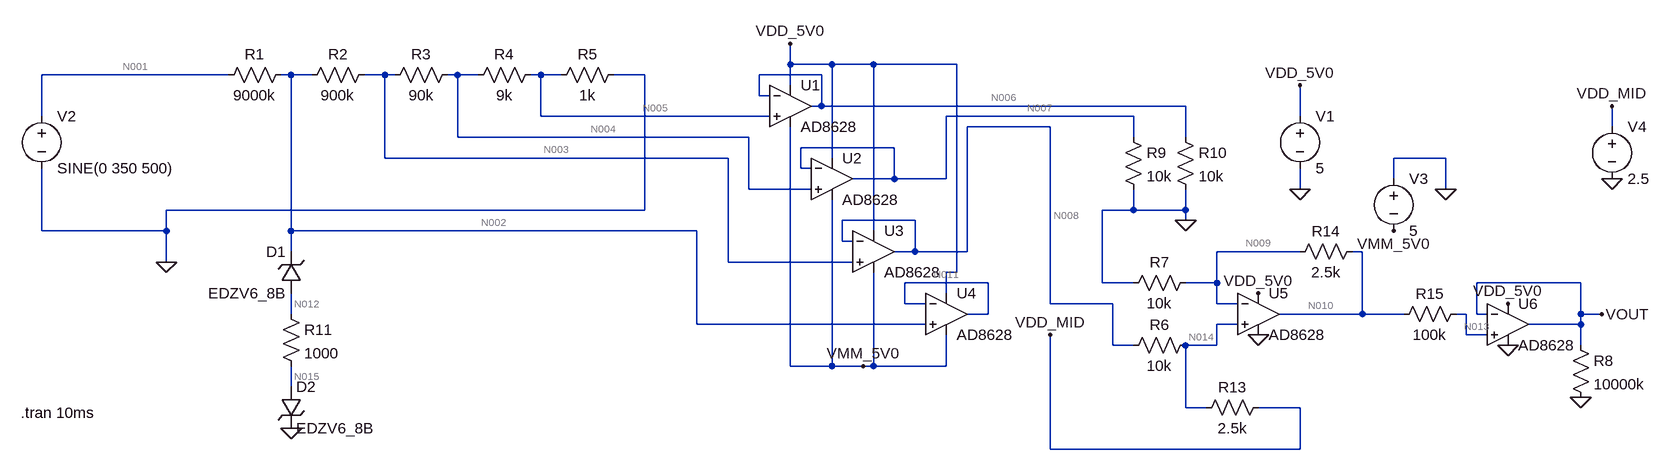
[diagram p0: schematic front_end_proto.asc]
front_end_proto.asc, the LTspice schematic file:
Version 4
SHEET 1 2288 680
WIRE 960 -320 960 -352
WIRE 1024 -320 960 -320
WIRE 1088 -320 1024 -320
WIRE 1216 -320 1088 -320
WIRE 96 -304 -192 -304
WIRE 192 -304 176 -304
WIRE 224 -304 192 -304
WIRE 336 -304 304 -304
WIRE 352 -304 336 -304
WIRE 448 -304 432 -304
WIRE 480 -304 448 -304
WIRE 576 -304 560 -304
WIRE 608 -304 576 -304
WIRE 736 -304 688 -304
WIRE 1008 -304 912 -304
WIRE 960 -288 960 -320
WIRE 912 -272 912 -304
WIRE 928 -272 912 -272
WIRE 1008 -256 1008 -304
WIRE 1008 -256 992 -256
WIRE 1568 -256 1008 -256
WIRE -192 -240 -192 -304
WIRE 576 -240 576 -304
WIRE 928 -240 576 -240
WIRE 1488 -240 1200 -240
WIRE 1744 -240 1744 -288
WIRE 1360 -224 1232 -224
WIRE 2224 -224 2224 -256
WIRE 448 -208 448 -304
WIRE 896 -208 448 -208
WIRE 1488 -208 1488 -240
WIRE 1568 -208 1568 -256
WIRE 1120 -192 976 -192
WIRE 336 -176 336 -304
WIRE 864 -176 336 -176
WIRE 1024 -176 1024 -320
WIRE 1968 -176 1888 -176
WIRE 976 -160 976 -192
WIRE 992 -160 976 -160
WIRE 1120 -144 1120 -192
WIRE 1120 -144 1056 -144
WIRE 1200 -144 1200 -240
WIRE 1200 -144 1120 -144
WIRE 1888 -144 1888 -176
WIRE 896 -128 896 -208
WIRE 992 -128 896 -128
WIRE 1744 -128 1744 -160
WIRE 1968 -128 1968 -176
WIRE 736 -96 736 -304
WIRE 736 -96 0 -96
WIRE 1488 -96 1488 -128
WIRE 1488 -96 1440 -96
WIRE 1568 -96 1568 -128
WIRE 1568 -96 1488 -96
WIRE 1152 -80 1040 -80
WIRE 1568 -80 1568 -96
WIRE -192 -64 -192 -160
WIRE 0 -64 0 -96
WIRE 0 -64 -192 -64
WIRE 192 -64 192 -304
WIRE 816 -64 192 -64
WIRE 1088 -64 1088 -320
WIRE 1040 -48 1040 -80
WIRE 1056 -48 1040 -48
WIRE 192 -32 192 -64
WIRE 1152 -32 1152 -80
WIRE 1152 -32 1120 -32
WIRE 1232 -32 1232 -224
WIRE 1232 -32 1152 -32
WIRE 1744 -32 1616 -32
WIRE 1840 -32 1824 -32
WIRE 0 -16 0 -64
WIRE 864 -16 864 -176
WIRE 1056 -16 864 -16
WIRE 1216 0 1216 -320
WIRE 1216 0 1200 0
WIRE 1264 16 1136 16
WIRE 1440 16 1440 -96
WIRE 1488 16 1440 16
WIRE 1616 16 1616 -32
WIRE 1616 16 1568 16
WIRE 2176 16 2016 16
WIRE 1200 32 1200 0
WIRE 1136 48 1136 16
WIRE 1168 48 1136 48
WIRE 1360 48 1360 -224
WIRE 1456 48 1360 48
WIRE 1616 48 1616 16
WIRE 1648 48 1616 48
WIRE 192 64 192 32
WIRE 1264 64 1264 16
WIRE 1264 64 1232 64
WIRE 1840 64 1840 -32
WIRE 1840 64 1712 64
WIRE 1904 64 1840 64
WIRE 2000 64 1984 64
WIRE 2016 64 2016 16
WIRE 2032 64 2016 64
WIRE 2176 64 2176 16
WIRE 2208 64 2176 64
WIRE 816 80 816 -64
WIRE 1168 80 816 80
WIRE 1648 80 1616 80
WIRE 2176 80 2176 64
WIRE 2176 80 2096 80
WIRE 2000 96 2000 64
WIRE 2032 96 2000 96
WIRE 1456 112 1456 48
WIRE 1488 112 1456 112
WIRE 1616 112 1616 80
WIRE 1616 112 1568 112
WIRE 2176 112 2176 80
WIRE 960 144 960 -224
WIRE 1024 144 1024 -112
WIRE 1024 144 960 144
WIRE 1072 144 1024 144
WIRE 1088 144 1088 0
WIRE 1088 144 1072 144
WIRE 1200 144 1200 96
WIRE 1200 144 1088 144
WIRE 192 176 192 144
WIRE 1568 208 1568 112
WIRE 1600 208 1568 208
WIRE 1744 208 1680 208
WIRE 1360 272 1360 96
WIRE 1744 272 1744 208
WIRE 1744 272 1360 272
FLAG 0 -16 0
FLAG 960 -352 VDD_5V0
FLAG 1568 -80 0
FLAG 1744 -288 VDD_5V0
FLAG 1744 -128 0
FLAG 1968 -128 0
FLAG 1888 -64 VMM_5V0
FLAG 1072 144 VMM_5V0
FLAG 1360 96 VDD_MID
FLAG 1680 96 0
FLAG 1680 32 VDD_5V0
FLAG 2224 -256 VDD_MID
FLAG 2208 64 VOUT
FLAG 2224 -144 0
FLAG 2176 192 0
FLAG 2064 112 0
FLAG 2064 48 VDD_5V0
FLAG 192 240 0
SYMBOL res 192 -320 R90
WINDOW 0 0 56 VBottom 2
WINDOW 3 32 56 VTop 2
SYMATTR InstName R1
SYMATTR Value 9000k
SYMBOL res 320 -320 R90
WINDOW 0 0 56 VBottom 2
WINDOW 3 32 56 VTop 2
SYMATTR InstName R2
SYMATTR Value 900k
SYMBOL res 448 -320 R90
WINDOW 0 0 56 VBottom 2
WINDOW 3 32 56 VTop 2
SYMATTR InstName R3
SYMATTR Value 90k
SYMBOL res 576 -320 R90
WINDOW 0 0 56 VBottom 2
WINDOW 3 32 56 VTop 2
SYMATTR InstName R4
SYMATTR Value 9k
SYMBOL res 704 -320 R90
WINDOW 0 0 56 VBottom 2
WINDOW 3 32 56 VTop 2
SYMATTR InstName R5
SYMATTR Value 1k
SYMBOL Opamps\\AD8628 960 -320 R0
SYMATTR InstName U1
SYMBOL Opamps\\AD8628 1024 -208 R0
SYMATTR InstName U2
SYMBOL Opamps\\AD8628 1088 -96 R0
SYMATTR InstName U3
SYMBOL res 1472 -224 R0
SYMATTR InstName R9
SYMATTR Value 10k
SYMBOL res 1552 -224 R0
SYMATTR InstName R10
SYMATTR Value 10k
SYMBOL voltage 1744 -256 R0
WINDOW 123 0 0 Left 0
WINDOW 39 0 0 Left 0
SYMATTR InstName V1
SYMATTR Value 5
SYMBOL voltage -192 -256 R0
WINDOW 123 0 0 Left 0
WINDOW 39 0 0 Left 0
SYMATTR InstName V2
SYMATTR Value SINE(0 350 500)
SYMBOL voltage 1888 -160 R0
WINDOW 123 0 0 Left 0
WINDOW 39 0 0 Left 0
SYMATTR InstName V3
SYMATTR Value 5
SYMBOL Opamps\\AD8628 1200 0 R0
SYMATTR InstName U4
SYMBOL Opamps\\AD8628 1680 0 R0
SYMATTR InstName U5
SYMBOL res 1584 96 R90
WINDOW 0 0 56 VBottom 2
WINDOW 3 32 56 VTop 2
SYMATTR InstName R6
SYMATTR Value 10k
SYMBOL res 1584 0 R90
WINDOW 0 0 56 VBottom 2
WINDOW 3 32 56 VTop 2
SYMATTR InstName R7
SYMATTR Value 10k
SYMBOL res 1696 192 R90
WINDOW 0 0 56 VBottom 2
WINDOW 3 32 56 VTop 2
SYMATTR InstName R13
SYMATTR Value 2.5k
SYMBOL res 1840 -48 R90
WINDOW 0 0 56 VBottom 2
WINDOW 3 32 56 VTop 2
SYMATTR InstName R14
SYMATTR Value 2.5k
SYMBOL res 2000 48 R90
WINDOW 0 0 56 VBottom 2
WINDOW 3 32 56 VTop 2
SYMATTR InstName R15
SYMATTR Value 100k
SYMBOL voltage 2224 -240 R0
WINDOW 123 0 0 Left 0
WINDOW 39 0 0 Left 0
SYMATTR InstName V4
SYMATTR Value 2.5
SYMBOL res 2160 96 R0
SYMATTR InstName R8
SYMATTR Value 10000k
SYMBOL Opamps\\AD8628 2064 16 R0
SYMATTR InstName U6
SYMBOL zener 208 32 R180
WINDOW 0 24 64 Left 2
WINDOW 3 24 0 Left 2
SYMATTR InstName D1
SYMATTR Value EDZV6_8B
SYMBOL zener 176 176 R0
SYMATTR InstName D2
SYMATTR Value EDZV6_8B
SYMBOL res 176 48 R0
SYMATTR InstName R11
SYMATTR Value 1000
TEXT -224 216 Left 2 !.tran 10ms

The netlist it stands for:
* front_end_proto.asc
R1 N002 N001 9000k
R2 N003 N002 900k
R3 N004 N003 90k
R4 N005 N004 9k
R5 0 N005 1k
XU1 N005 N006 VDD_5V0 VMM_5V0 N006 AD8628  ; pins In+ In- V+ V- OUT
XU2 N004 N007 VDD_5V0 VMM_5V0 N007 AD8628  ; pins In+ In- V+ V- OUT
XU3 N003 N008 VDD_5V0 VMM_5V0 N008 AD8628  ; pins In+ In- V+ V- OUT
R9 N007 0 10k
R10 N006 0 10k
V1 VDD_5V0 0 5
V2 N001 0 SINE(0 350 500)
V3 0 VMM_5V0 5
XU4 N002 N011 VDD_5V0 VMM_5V0 N011 AD8628  ; pins In+ In- V+ V- OUT
XU5 N014 N009 VDD_5V0 0 N010 AD8628  ; pins In+ In- V+ V- OUT
R6 N014 N008 10k
R7 N009 0 10k
R13 VDD_MID N014 2.5k
R14 N010 N009 2.5k
R15 N013 N010 100k
V4 VDD_MID 0 2.5
R8 VOUT 0 10000k
XU6 N013 VOUT VDD_5V0 0 VOUT AD8628  ; pins In+ In- V+ V- OUT
D1 N012 N002 EDZV6_8B
D2 N015 0 EDZV6_8B
R11 N012 N015 1000
.model D D
.lib standard.dio
.tran 10ms
.backanno
.end

* Results of the author's LTspice run, read from the files saved beside the schematic
* Operating Point, zero values left out:
*   V(n002) = -25 µV
*   V(n003) = -4.997 µV
*   V(n004) = -747.2 nV
*   V(n005) = -97.22 nV
*   V(n006) = 902.9 nV
*   V(vmm_5v0) = -5 V
*   V(vdd_5v0) = 5 V
*   V(n007) = 252.9 nV
*   V(n008) = -3.938 µV
*   V(n011) = -24 µV
*   V(n009) = 2 V
*   V(n014) = 2 V
*   V(n010) = 2.5 V
*   V(vdd_mid) = 2.5 V
*   V(n013) = 2.5 V
*   V(vout) = 2.5 V
*   V(n012) = -12.5 µV
*   V(n015) = -12.5 µV
*   I(R8) = 250 nA
*   I(R15) = -25 pA
*   I(R14) = 200 µA
*   I(R13) = 200 µA
*   I(R7) = 200 µA
*   I(R6) = 200 µA
*   I(R10) = 90.29 pA
*   I(R9) = 25.29 pA
*   I(R5) = 97.22 pA
*   I(R4) = 72.22 pA
*   I(R3) = 47.22 pA
*   I(R2) = 22.22 pA
*   I(R1) = -2.777 pA
*   I(V4) = -200 µA
*   I(V3) = -3.94 mA
*   I(V2) = -2.777 pA
*   I(V1) = -5.298 mA
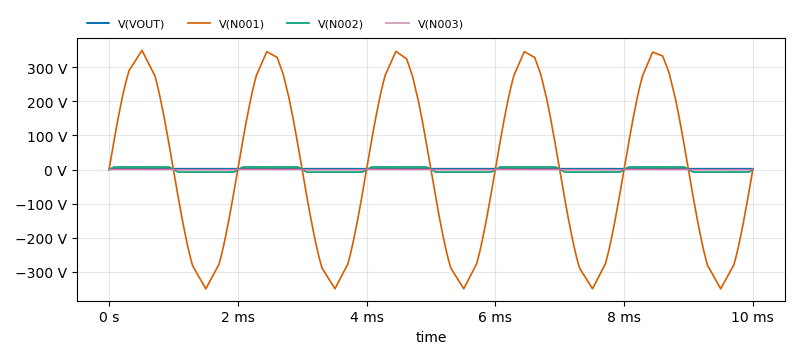
[diagram p1: Transient Analysis of front_end_proto.asc, plotted from the saved traces]
* Transient Analysis, 1 run:
*   V(VOUT): min 2.313 V, max 2.687 V, average 2.5 V, rms 2.506 V, last 2.485 V
*   V(N001): min -349.6 V, max 349.4 V, average 763.6 mV, rms 243.1 V, last 0 V
*   V(N002): min -7.49 V, max 7.49 V, average -2.042 mV, rms 7.109 V, last -578.8 mV
*   V(N003): min -749 mV, max 749 mV, average -206.7 µV, rms 710.9 mV, last -57.88 mV